# Altium schematic sheet Master.SchDoc
size A4
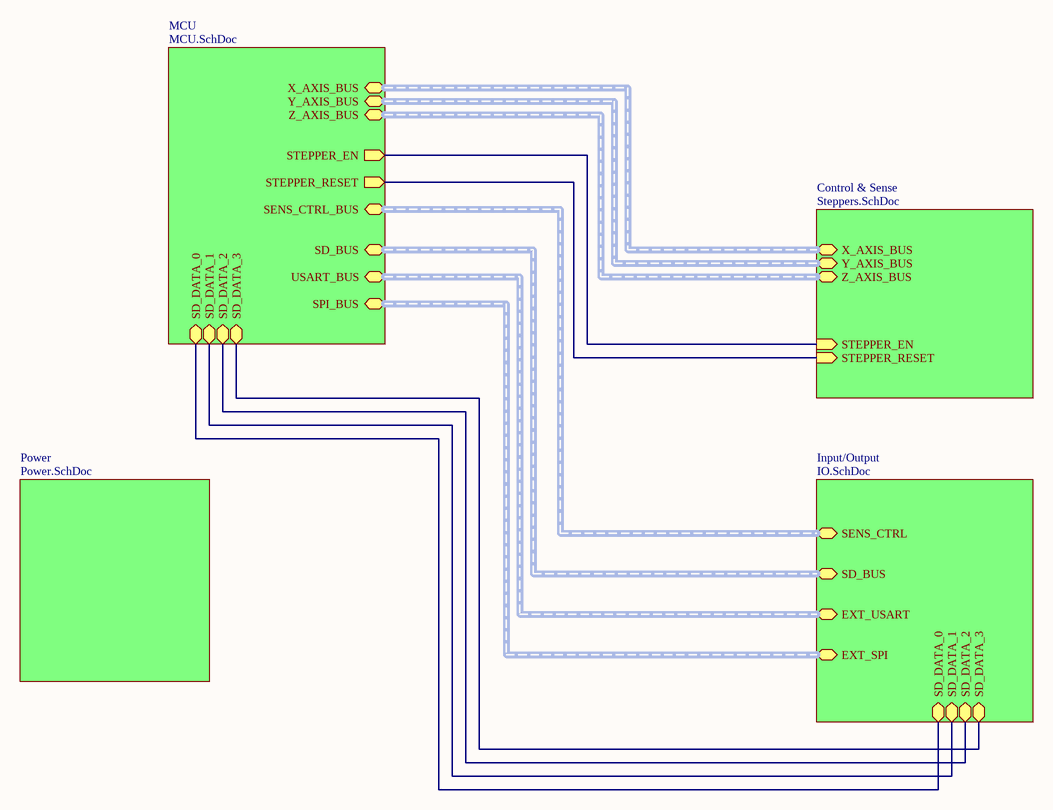
[diagram p0: Master.SchDoc]

## Sub-sheets
Control & Sense = Steppers.SchDoc: X_AXIS_BUS (harness STEPPER), Y_AXIS_BUS (harness STEPPER), Z_AXIS_BUS (harness STEPPER), STEPPER_EN (in), STEPPER_RESET (in)
Input/Output = IO.SchDoc: SENS_CTRL (harness SENS_CTRL), SD_BUS (harness SD_CARD), EXT_USART (harness USART), EXT_SPI (harness SPI), SD_DATA_0 (bidir), SD_DATA_1 (bidir), SD_DATA_2 (bidir), SD_DATA_3 (bidir)
MCU = MCU.SchDoc: X_AXIS_BUS (harness STEPPER), Y_AXIS_BUS (harness STEPPER), Z_AXIS_BUS (harness STEPPER), STEPPER_EN (out), STEPPER_RESET (out), SENS_CTRL_BUS (harness SENS_CTRL), USART_BUS (harness USART), SD_BUS (harness SD_CARD), SPI_BUS (harness SPI), SD_DATA_0 (bidir), SD_DATA_1 (bidir), SD_DATA_2 (bidir), SD_DATA_3 (bidir)
Power = Power.SchDoc: no entries

## Nets
(unnamed): sheet MCU/STEPPER_EN, sheet Control & Sense/STEPPER_EN
(unnamed): sheet MCU/STEPPER_RESET, sheet Control & Sense/STEPPER_RESET
(unnamed): sheet MCU/SD_DATA_0, sheet Input/Output/SD_DATA_0
(unnamed): sheet MCU/SD_DATA_1, sheet Input/Output/SD_DATA_1
(unnamed): sheet MCU/SD_DATA_2, sheet Input/Output/SD_DATA_2
(unnamed): sheet MCU/SD_DATA_3, sheet Input/Output/SD_DATA_3

## Buses and harness runs
harness sheet Control & Sense/X_AXIS_BUS = sheet MCU/X_AXIS_BUS
harness sheet Control & Sense/Y_AXIS_BUS = sheet MCU/Y_AXIS_BUS
harness sheet Control & Sense/Z_AXIS_BUS = sheet MCU/Z_AXIS_BUS
harness sheet Input/Output/EXT_SPI = sheet MCU/SPI_BUS
harness sheet Input/Output/EXT_USART = sheet MCU/USART_BUS
harness sheet Input/Output/SD_BUS = sheet MCU/SD_BUS
harness sheet Input/Output/SENS_CTRL = sheet MCU/SENS_CTRL_BUS